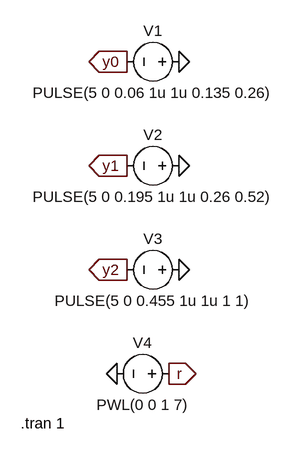
[diagram p0: schematic Draft5.asc]
Draft5.asc, the LTspice schematic file:
Version 4
SHEET 1 880 680
FLAG 192 64 0
FLAG 192 224 0
FLAG 192 384 0
FLAG 112 64 y0
IOPIN 112 64 Out
FLAG 112 224 y1
IOPIN 112 224 Out
FLAG 112 384 y2
IOPIN 112 384 Out
FLAG 96 544 0
FLAG 176 544 r
IOPIN 176 544 Out
SYMBOL voltage 208 64 R90
WINDOW 0 -32 56 VBottom 2
WINDOW 3 32 56 VTop 2
WINDOW 123 0 0 Left 0
WINDOW 39 0 0 Left 0
SYMATTR InstName V1
SYMATTR Value PULSE(5 0 0.06 1u 1u 0.135 0.26)
SYMBOL voltage 208 224 R90
WINDOW 0 -32 56 VBottom 2
WINDOW 3 32 56 VTop 2
WINDOW 123 0 0 Left 0
WINDOW 39 0 0 Left 0
SYMATTR InstName V2
SYMATTR Value PULSE(5 0 0.195 1u 1u 0.26 0.52)
SYMBOL voltage 208 384 R90
WINDOW 0 -32 56 VBottom 2
WINDOW 3 32 56 VTop 2
WINDOW 123 0 0 Left 0
WINDOW 39 0 0 Left 0
SYMATTR InstName V3
SYMATTR Value PULSE(5 0 0.455 1u 1u 1 1)
SYMBOL voltage 192 544 R90
WINDOW 0 -32 56 VBottom 2
WINDOW 3 32 56 VTop 2
WINDOW 123 0 0 Left 0
WINDOW 39 0 0 Left 0
SYMATTR InstName V4
SYMATTR Value PWL(0 0 1 7)
TEXT -52 620 Left 2 !.tran 1

The netlist it stands for:
* Draft5.asc
V1 0 y0 PULSE(5 0 0.06 1u 1u 0.135 0.26)
V2 0 y1 PULSE(5 0 0.195 1u 1u 0.26 0.52)
V3 0 y2 PULSE(5 0 0.455 1u 1u 1 1)
V4 r 0 PWL(0 0 1 7)
.tran 1
.backanno
.end